# EAGLE design blade-plate-head (EAGLE 9.6.0)
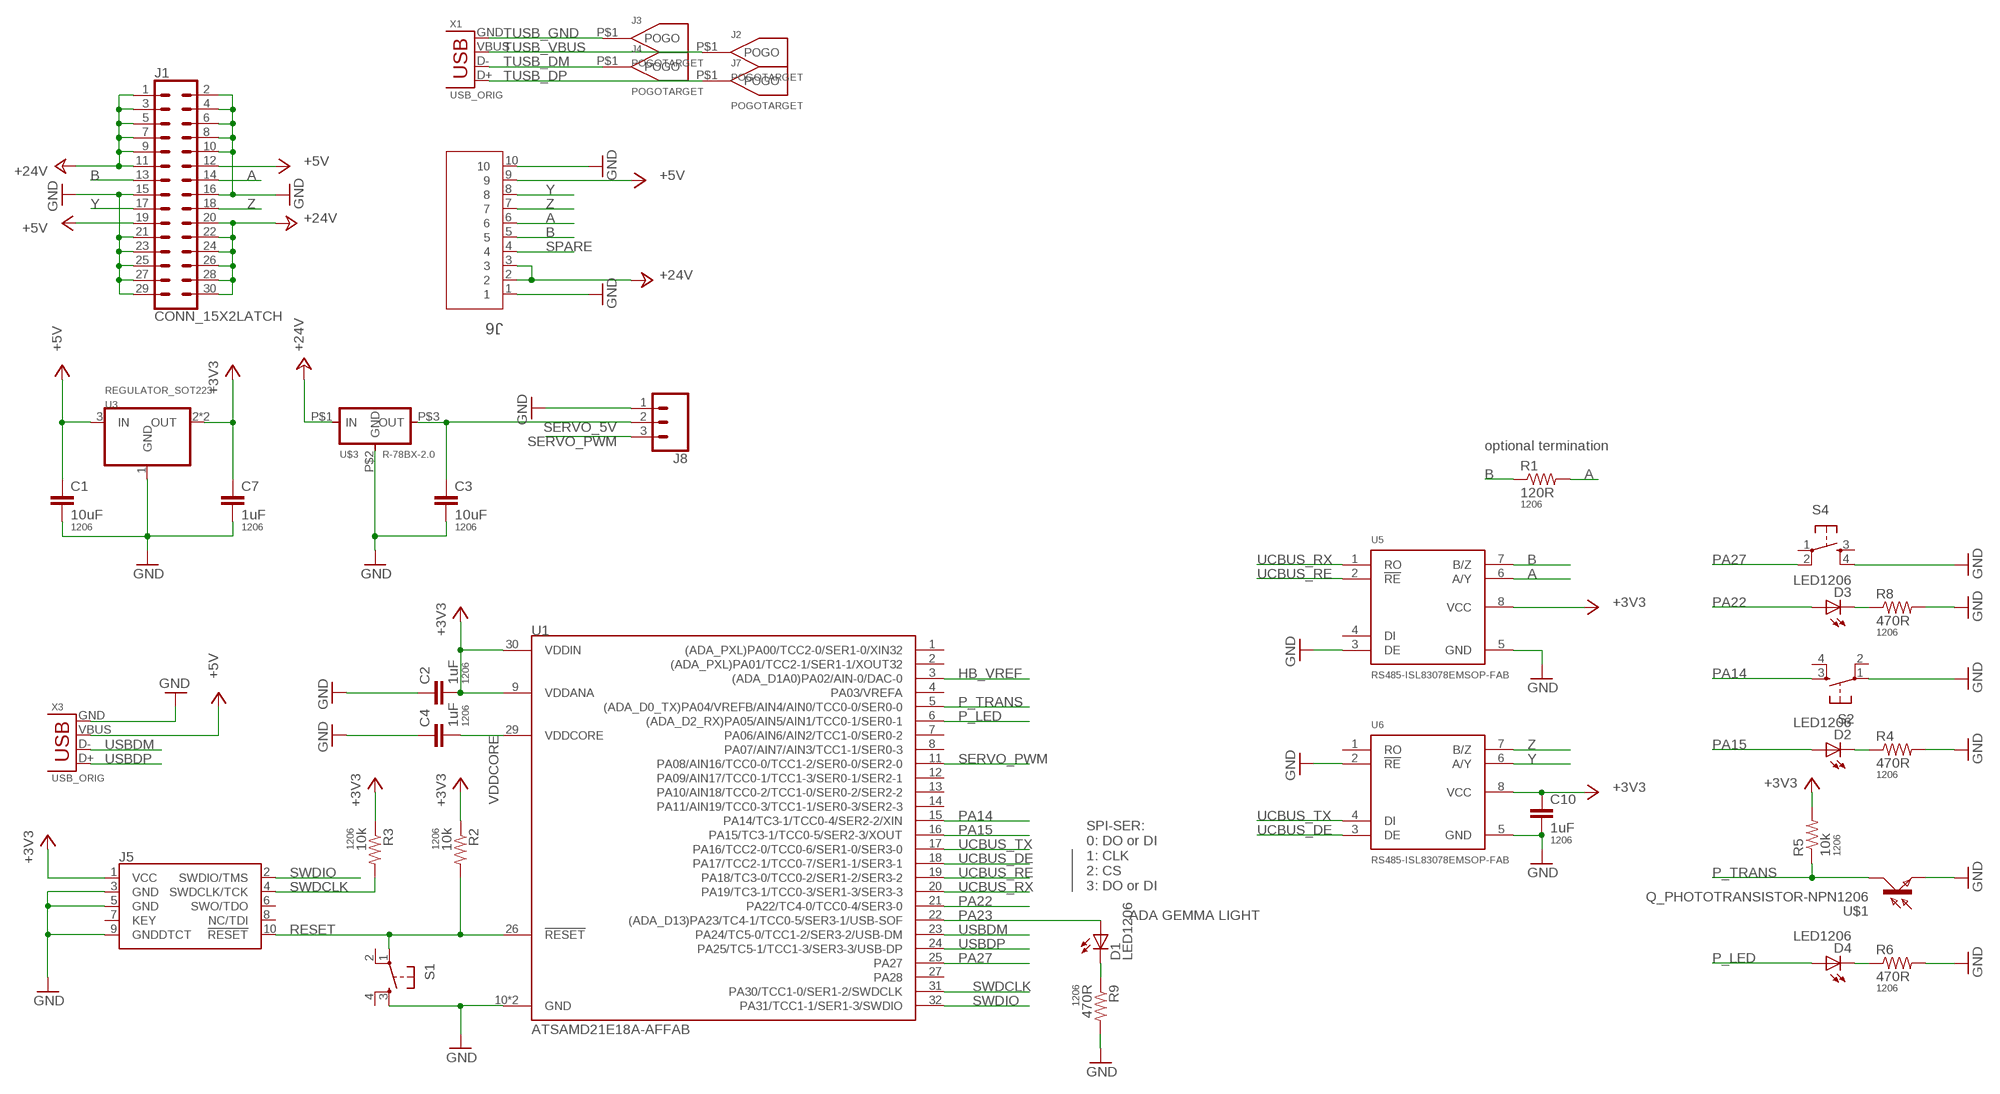
[diagram p0: schematic, sheet 1]

## Parts
C1  10uF  CAP1206  [1206]
C2  1uF  CAP1206  [1206]
C3  10uF  CAP1206  [1206]
C4  1uF  CAP1206  [1206]
C7  1uF  CAP1206  [1206]
C10  1uF  CAP1206  [1206]
D1  LED1206  [LED1206]
D2  LED1206  [LED1206]
D3  LED1206  [LED1206]
D4  LED1206  [LED1206]
J1  CONN_15X2LATCH  [2X15-SHROUDED_LATCH]
J2  POGOTARGET  [POGO_TARGET]
J3  POGOTARGET  [POGO_TARGET]
J4  POGOTARGET  [POGO_TARGET]
J5  CORTEX_JTAG_DEBUG_PTH_NS  [2X5-PTH-1.27MM-NO_SILK]
J6  BLADE_10P_SCKT_1-1674231-1  [TE_1-1674231-1]
J7  POGOTARGET  [POGO_TARGET]
J8  CONN_03LOCK_NO_SILK  [1X03_LOCK_NO_SILK]
R1  120R  RESISTOR1206  [1206]
R2  10k  RESISTOR1206  [1206]
R3  10k  RESISTOR1206  [1206]
R4  470R  RESISTOR1206  [1206]
R5  10k  RESISTOR1206  [1206]
R6  470R  RESISTOR1206  [1206]
R8  470R  RESISTOR1206  [1206]
R9  470R  RESISTOR1206  [1206]
S1  SW_SWITCH_TACTILE_6MM6MM_SWITCH  [6MM_SWITCH]
S2  SW_SWITCH_TACTILE_6MM6MM_SWITCH  [6MM_SWITCH]
S4  SW_SWITCH_TACTILE_6MM6MM_SWITCH  [6MM_SWITCH]
U1  ATSAMD21E18A-AFFAB  [TQFP-32-FAB]
U3  REGULATOR_SOT223  [SOT223]
U5  RS485-ISL83078EMSOP-FAB  [8-MSOP-FAB]
U6  RS485-ISL83078EMSOP-FAB  [8-MSOP-FAB]
U$1  Q_PHOTOTRANSISTOR-NPN1206  [OP1206]
U$3  R-78BX-2.0  [R-78BX-2.0]
X1  USB_ORIG  [DX4R005HJ5]
X3  USB_ORIG  [DX4R005HJ5]

## Nets
+3V3: C2.2 C7.1 C10.1 J5.1(VCC) R2.1 R3.1 R5.2 U1.9(VDDANA) U1.30(VDDIN) U3.2(OUT) U3.4(OUT) U5.8(VCC) U6.8(VCC)
+5V: C1.1 J1.12 J1.19 J6.9 U3.3(IN) X3.VBUS
+24V: J1.1 J1.3 J1.5 J1.7 J1.9 J1.11 J1.20 J1.22 J1.24 J1.26 J1.28 J1.30 J6.2 J6.3 U$3.P$1(IN)
A: J1.14 J6.6 R1.2 U5.6(A/Y)
B: J1.13 J6.5 R1.1 U5.7(B/Z)
GND: C1.2 C2.1 C3.2 C4.1 C7.2 C10.2 J1.2 J1.4 J1.6 J1.8 J1.10 J1.15 J1.16 J1.21 J1.23 J1.25 J1.27 J1.29 J5.3(GND) J5.5(GND) J5.9(GNDDTCT) J6.1 J6.10 J8.1 R4.2 R6.2 R8.2 R9.2 S1.3(S) S2.1(P) S4.4(S1) U1.10(GND) U1.28(GND) U3.1(GND) U5.3(DE) U5.5(GND) U6.2(!RE) U6.5(GND) U$1.EMITTER(E) U$3.P$2(GND) X3.GND
HB_VREF: U1.3((ADA_D1A0)PA02/AIN-0/DAC-0)
N$1: D3.2(C) R8.1
N$2: D2.2(C) R4.1
N$3: D4.2(C) R6.1
N$6: D1.2(C) R9.1
P_LED: D4.1(A) U1.6((ADA_D2_RX)PA05/AIN5/AIN1/TCC0-1/SER0-1)
P_TRANS: R5.1 U1.5((ADA_D0_TX)PA04/VREFB/AIN4/AIN0/TCC0-0/SER0-0) U$1.COLLECTOR(C)
PA14: S2.3(S) U1.15(PA14/TC3-1/TCC0-4/SER2-2/XIN)
PA15: D2.1(A) U1.16(PA15/TC3-1/TCC0-5/SER2-3/XOUT)
PA22: D3.1(A) U1.21(PA22/TC4-0/TCC0-4/SER3-0)
PA23: D1.1(A) U1.22((ADA_D13)PA23/TC4-1/TCC0-5/SER3-1/USB-SOF)
PA27: S4.2(P1) U1.25(PA27)
RESET: J5.10(!RESET) R2.2 S1.1(P) U1.26(!RESET)
SERVO_5V: C3.1 J8.2 U$3.P$3(OUT)
SERVO_PWM: J8.3 U1.11(PA08/AIN16/TCC0-0/TCC1-2/SER0-0/SER2-0)
SPARE: J6.4
SWDCLK: J5.4(SWDCLK/TCK) R3.2 U1.31(PA30/TCC1-0/SER1-2/SWDCLK)
SWDIO: J5.2(SWDIO/TMS) U1.32(PA31/TCC1-1/SER1-3/SWDIO)
TUSB_DM: J4.P$1(POGO) X1.D-
TUSB_DP: J7.P$1(POGO) X1.D+
TUSB_GND: J3.P$1(POGO) X1.GND
TUSB_VBUS: J2.P$1(POGO) X1.VBUS
UCBUS_DE: U1.18(PA17/TCC2-1/TCC0-7/SER1-1/SER3-1) U6.3(DE)
UCBUS_RE: U1.19(PA18/TC3-0/TCC0-2/SER1-2/SER3-2) U5.2(!RE)
UCBUS_RX: U1.20(PA19/TC3-1/TCC0-3/SER1-3/SER3-3) U5.1(RO)
UCBUS_TX: U1.17(PA16/TCC2-0/TCC0-6/SER1-0/SER3-0) U6.4(DI)
USBDM: U1.23(PA24/TC5-0/TCC1-2/SER3-2/USB-DM) X3.D-
USBDP: U1.24(PA25/TC5-1/TCC1-3/SER3-3/USB-DP) X3.D+
VDDCORE: C4.2 U1.29(VDDCORE)
Y: J1.17 J6.8 U6.6(A/Y)
Z: J1.18 J6.7 U6.7(B/Z)
Unconnected: J5.6(SWO/TDO) J5.7(KEY) J5.8(NC/TDI) S1.2(P1) S1.4(S1) S2.2(P1) S2.4(S1) S4.1(P) S4.3(S) U1.1((ADA_PXL)PA00/TCC2-0/SER1-0/XIN32) U1.2((ADA_PXL)PA01/TCC2-1/SER1-1/XOUT32) U1.4(PA03/VREFA) U1.7(PA06/AIN6/AIN2/TCC1-0/SER0-2) U1.8(PA07/AIN7/AIN3/TCC1-1/SER0-3) U1.12(PA09/AIN17/TCC0-1/TCC1-3/SER0-1/SER2-1) U1.13(PA10/AIN18/TCC0-2/TCC1-0/SER0-2/SER2-2) U1.14(PA11/AIN19/TCC0-3/TCC1-1/SER0-3/SER2-3) U1.27(PA28) U5.4(DI) U6.1(RO)

## Notes on the sheet
- optional termination
- SPI-SER:
  0: DO or DI
  1: CLK
  2: CS
  3: DO or DI
- ADA GEMMA LIGHT

## Library data of the parts
C1-C4 C7 C10 = passives:CAP: Capacitor Standard 0603 ceramic capacitor, and 0.1" leaded capacitor.; PACKAGE: 1206
D1-D4 = lights:LED: LED
J1 = SparkFun-Connectors:CONN_15X2
J2-J4 J7 = connector:POGO
J5 = SparkFun-Connectors:CORTEX_JTAG_DEBUG: Cortex Debug Connector - 10 pin Supports JTAG debug, Serial Wire debug, and Serial Wire Viewer. PTH and SMD connector options available. General Connector Information <http://infocenter.arm.com/help/topic/com.arm.doc.faqs/attached/13634/cortex_debug_connectors.pdf> Products: PTH Connector <http://www.digikey.com/product-detail/en/cnc-tech/3220-10-0100-00/1175-1627-ND/3883661> -via Digi-Key SparkFun PSoc <https://www.sparkfun.com/products/13229> SparkFun T <https://www.sparkfun.com/products/13810>
J6 = connector:BLADE_10P_SCKT_1-1674231-1: Check prices <https://pricing.snapeda.com/parts/1-1674231-1/TE%20Connectivity/view-part?ref=eda>; AVAILABILITY: In Stock; COMMENT: 1-1674231-1; DESCRIPTION: Conn Battery RCP 10Power POS 2.5mm Solder ST Thru-Hole 10 Terminal 1 Port Tray; EU_ROHS_COMPLIANCE: Compliant; MF: TE Connectivity; MP: 1-1674231-1; PACKAGE: None; PRICE: None; PURCHASE-URL: https://pricing.snapeda.com/search/part/1-1674231-1/?ref=eda
J8 = SparkFun-Connectors:CONN_03: Multi connection point. Often used as Generic Header-pin footprint for 0.1 inch spaced/style header connections On any of the 0.1 inch spaced packages, you can populate with these: Break Away Headers - Straight <https://www.sparkfun.com/products/116> (PRT-00116) Break Away Male Headers - Right Angle <https://www.sparkfun.com/products/553> (PRT-00553) Female Headers <https://www.sparkfun.com/products/115> (PRT-00115) Break Away Headers - Machine Pin <https://www.sparkfun.com/products/117> (PRT-00117) Break Away Female Headers - Swiss Machine Pin <https://www.sparkfun.com/products/743> (PRT-00743) Stackable Header - 3 Pin (Female, 0.1") <https://www.sparkfun.com/products/13875> (PRT-13875) For SCREWTERMINALS and SPRING TERMINALS visit here: Screw Terimnals on SparkFun.com <https://www.sparkfun.com/search/results?term=Screw+Terminals> (5mm/3.5mm/2.54mm spacing) This device is also useful as a general connection point to wire up your design to another part of your project. Our various solder wires solder well into these plated through hole pads. Hook-Up Wire - Assortment (Stranded, 22 AWG) <https://www.sparkfun.com/products/11375> (PRT-11375) Hook-Up Wire - Assortment (Solid Core, 22 AWG) <https://www.sparkfun.com/products/11367> (PRT-11367) View the entire wire category on our website here <https://www.sparkfun.com/categories/141> Special notes: Molex polarized connector foot print use with SKU : PRT-08232 with associated crimp pins and housings.
R1-R6 R8 R9 = passives:RESISTOR: Resistor Basic schematic elements and footprints for 0603, 1206, and PTH resistors.; PACKAGE: 1206
S1 S2 S4 = fablab:SW_SWITCH_TACTILE_6MM: OMRON SWITCH
U1 = microcontrollers:ATSAMD21E18A-AF: The SAM D21 is a series of low-power microcontrollers using the 32-bit ARM® Cortex® -M0+ processor, and ranging from 32- to 64-pins with up to 256KB Flash and 32KB of SRAM. The SAM D21 operate at a maximum frequency of 48MHz and reach 2.46 CoreMark® /MHz. Check prices <https://pricing.snapeda.com/parts/ATSAMD21E18A-AF/Microchip/view-part?ref=eda>
U3 = power:REGULATOR_SOT223
U5 U6 = comm:RS485-ISL83078E
U$1 = fablab:Q_PHOTOTRANSISTOR-NPN
U$3 = power:R-78BX-2.0
X1 X3 = connector:USB: SMD micro USB connector as found in the fablab inventory. Three footprint variants included: 609-4613-1-ND used by Jake original, as described by manufacturer's datasheet for milling with the 1/100" bit for milling with the 1/64" bit Made by Zaerc.

## Board
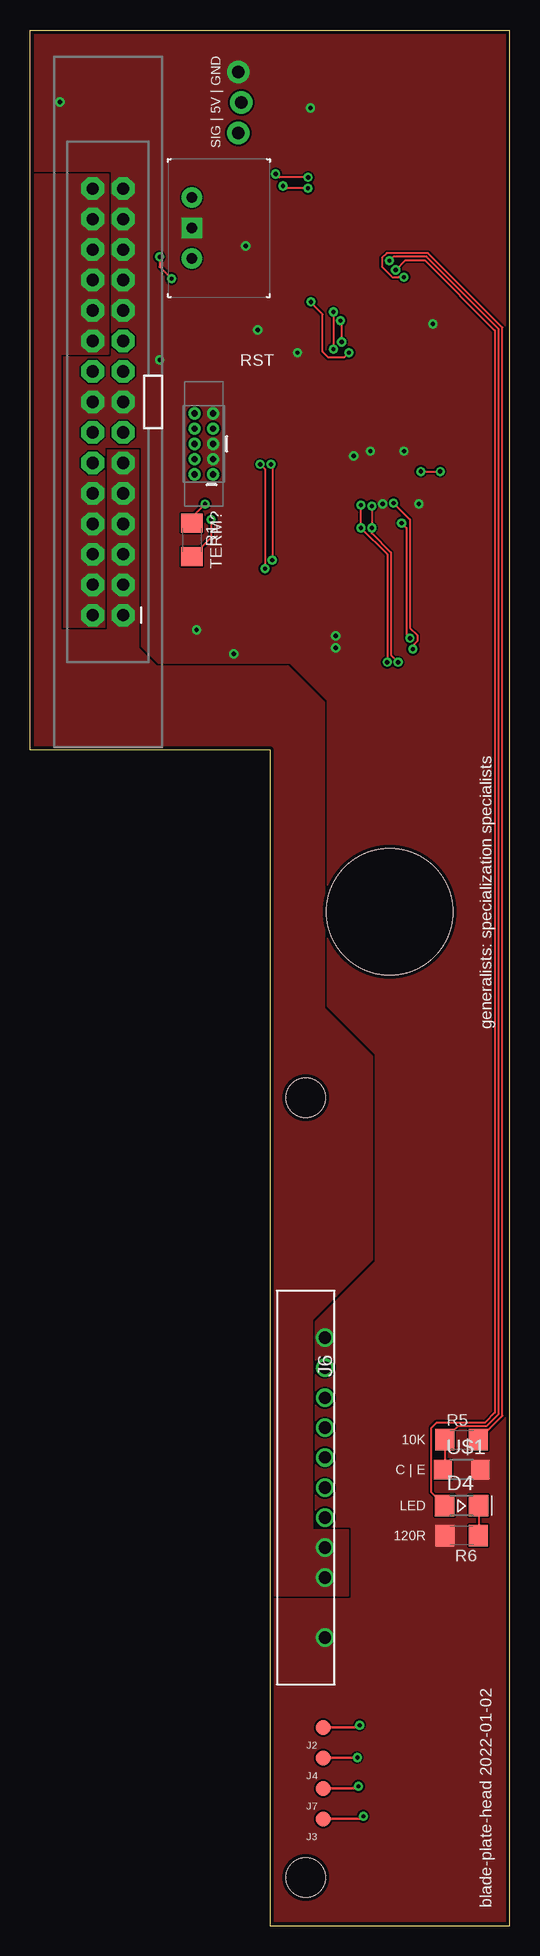
[diagram p1: board, top side]
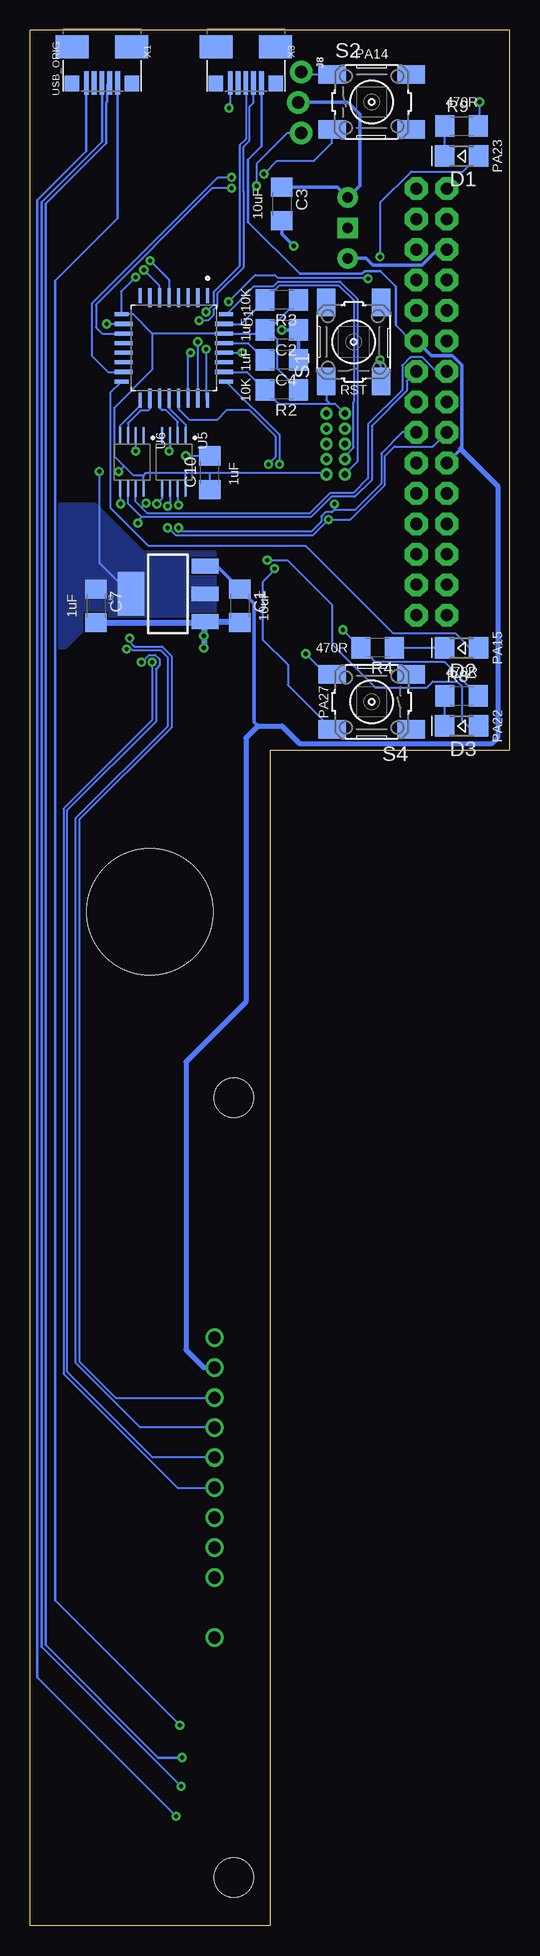
[diagram p2: board, bottom side, seen from below]

Size 40 x 158 mm. Coordinates in mm from the lower left corner, seen from the top.
Outline: 20,0 40,0 40,158 0,158 0,98 20,98 20,0
Copper layers (1*16): Top 0.035mm / dielectric 1.5mm / Bottom 0.035mm
Design rules "default *": minimum track width 6mil, minimum drill 0.35mm, track to track 6mil, track to pad 6mil, pad to pad 6mil, via to via 6mil, smd to smd 6mil, copper to edge 12mil, drill to drill 6mil, minimum pad ring 10mil, minimum via ring 8mil, stop-mask expansion 4mil, vias tented up to drill 35mil, thermal gap 10mil
Holes 3.25 mm at 23,69 23,4
Holes 10.5 mm at 30,84.5

### Footprints (pad centres in the part's own frame; a part is rotated, then mirrored left to right if it is on the bottom)
1206 = smd 1.6 x 1.8: 1 -1.4,0; 2 1.4,0
LED1206 = smd 1.6 x 1.803: 1 -1.422,0; 2 1.422,0
2X15-SHROUDED_LATCH = drill 1.016 pad 1.88 octagon: 1 -1.27,17.78; 2 1.27,17.78; 3 -1.27,15.24; 4 1.27,15.24; 5 -1.27,12.7; 6 1.27,12.7; 7 -1.27,10.16; 8 1.27,10.16; 9 -1.27,7.62; 10 1.27,7.62; 11 -1.27,5.08; 12 1.27,5.08; 13 -1.27,2.54; 14 1.27,2.54; 15 -1.27,0; 16 1.27,0; 17 -1.27,-2.54; 18 1.27,-2.54; 19 -1.27,-5.08; 20 1.27,-5.08; 21 -1.27,-7.62; 22 1.27,-7.62; 23 -1.27,-10.16; 24 1.27,-10.16; 25 -1.27,-12.7; 26 1.27,-12.7; 27 -1.27,-15.24; 28 1.27,-15.24; 29 -1.27,-17.78; 30 1.27,-17.78
POGO_TARGET = smd 1.27 x 1.27: P$1 0,0
2X5-PTH-1.27MM-NO_SILK = drill 0.508 pad 1: 1 -2.54,-0.762; 2 -2.54,0.762; 3 -1.27,-0.762; 4 -1.27,0.762; 5 0,-0.762; 6 0,0.762; 7 1.27,-0.762; 8 1.27,0.762; 9 2.54,-0.762; 10 2.54,0.762
TE_1-1674231-1 = drill 1.016 pad 1.524: 1 -12.5,0; 2 -7.496,0; 3 -5.007,0; 4 -2.492,0; 5 -0.003,0; 6 2.511,0; 7 5.001,0; 8 7.49,0; 9 10.004,0; 10 12.494,0
1X03_LOCK_NO_SILK = drill 1.016 pad 1.88: 1 0,0.127; 2 2.54,-0.127; 3 5.08,0.127
6MM_SWITCH = smd 2.286 x 1.524: 1 -3.302,2.286; 2 3.302,2.286; 3 -3.302,-2.286; 4 3.302,-2.286
TQFP-32-FAB = smd 1.25 x 0.35: 1 -4.355,2.8; 8 -4.355,-2.8; 17 4.355,-2.8; 24 4.355,2.8 | smd 1.6 x 0.35: 2 -4.18,2; 3 -4.18,1.2; 4 -4.18,0.4; 5 -4.18,-0.4; 6 -4.18,-1.2; 7 -4.18,-2; 18 4.18,-2; 19 4.18,-1.2; 20 4.18,-0.4; 21 4.18,0.4; 22 4.18,1.2; 23 4.18,2 | smd 0.35 x 1.25: 9 -2.8,-4.355; 16 2.8,-4.355; 25 2.8,4.355; 32 -2.8,4.355 | smd 0.35 x 1.6: 10 -2,-4.18; 11 -1.2,-4.18; 12 -0.4,-4.18; 13 0.4,-4.18; 14 1.2,-4.18; 15 2,-4.18; 26 2,4.18; 27 1.2,4.18; 28 0.4,4.18; 29 -0.4,4.18; 30 -1.2,4.18; 31 -2,4.18
SOT223 = smd 1.219 x 2.235: 1 -2.311,-3.099; 2 0,-3.099; 3 2.311,-3.099 | smd 3.6 x 2.2: 4 0,3.099
8-MSOP-FAB = smd 1.4 x 0.22: 1 -2.2,0.975; 2 -2.2,0.325; 3 -2.2,-0.325; 4 -2.2,-0.975; 5 2.2,-0.975; 6 2.2,-0.325; 7 2.2,0.325; 8 2.2,0.975
OP1206 = smd 1.5 x 1.6: COLLECTOR -1.55,0; EMITTER 1.55,0
R-78BX-2.0 = drill 0.9 pad 1.676: P$1 -2.54,0; P$3 2.54,0 | drill 0.9 pad 1.676 square: P$2 0,0
DX4R005HJ5 = smd 0.4 x 1.95: D+ 0,1.9; D- -0.65,1.9; GND 1.3,1.9; ID 0.65,1.9; VBUS -1.3,1.9 | smd 1.2 x 1.3: GND@1 -2.5,1.95; GND@2 2.5,1.95 | smd 2.75 x 1.9: GND@3 -2.475,-1.1; GND@4 2.475,-1.1

### Placement (x,y rotation side)
C1  22.5,110 270 bottom
C2  19,133 180 bottom
C3  19,143.5 270 bottom
C4  19,130.5 180 bottom
C7  34.5,110 270 bottom
C10  25,121.1 90 bottom
D1  4,147.5 180 bottom
D2  4,106.5 180 bottom
D3  4,100 180 bottom
D4  36,35 0 top
J1  6.5,127 180 top
J2  24.45,16.51 0 top
J3  24.45,8.89 0 top
J4  24.45,13.97 0 top
J5  14.5,123.5 90 top
J6  24.6,36.5 90 top
J7  24.45,11.43 0 top
J8  17.5,154.5 270 bottom
R1  13.5,115.5 270 top
R2  19,128 180 bottom
R3  19,135.5 180 bottom
R4  11,106.5 180 bottom
R5  36,40.5 0 top
R6  36,32.5 180 top
R8  4,102.5 0 bottom
R9  4,150 0 bottom
S1  13,132 90 bottom
S2  11.5,152 0 bottom
S4  11.5,102 180 bottom
U1  28,131.5 270 bottom
U3  28.5,111 90 bottom
U5  28,122 270 bottom
U6  31.5,122 270 bottom
U$1  36,38 0 top
U$3  13.5,141.5 90 top
X1  34,155.5 180 bottom
X3  22,155.5 180 bottom

### Tracks (layer width: path | path; a pad name or v marks a point on that pad's centre or on a via)
+3V3  (via drill 0.35)
  Top 0.152: v32.6,121.2 v34.22,121.2 | R5.2 39.4,42.5 39.4,133.2 33.19,139.41 29.77,139.41 29.37,139.01 29.37,138.27 30.25,137.39 30.75,137.39 30.77,137.41 v31.19,137.41
  Bottom 0.152: 20.2,133 C2.2 20.7,132.7 U1.30 29.8,132.7 | 20.2,133 20.1,133 R3.1 | R2.1 19.37,129.77 19.37,132.17 20.2,133 | 29.8,132.7 31.4,134.3 32.3,134.3 | 32.3,134.3 U1.9 | U6.8 30.52,120.88 30.5,120.9 | 26.9,121.1 30.3,121.1 30.5,120.9 | U5.8 27.02,120.97 26.9,121.1 | J5.1 15.4,121.1 25,121.1 | 26.9,121.1 25,121.1 | C10.1 25,121.1 | 30.5,120.9 31.4,120.9 32.1,121.6 | 29.8,132.7 29.8,129.7 33,126.5 33,122.5 32.1,121.6 | 32.1,121.6 32.2,121.6 v32.6,121.2 | v34.22,121.2 34.22,113.62 U3.4 | 32.3,134.3 32.4,134.4 32.4,136.2 v31.19,137.41
  pour Bottom (no thermals): 24.5,114.5 30.5,114.5 34.5,118.5 40.5,118.5 40.5,106.5 37,106.5 35,108.5 24.5,108.5
+5V
  Bottom 0.203: J1.19 8.18,132.08 9.5,133.4 9.5,136.62 10.78,137.9 12.06,137.9 12.29,137.67 17.47,137.67 21.8,142 21.8,147.2 20.7,148.3 X3.VBUS
  Bottom 0.305: U3.3 24.41,113.31 C1.1 21.3,110.19 21.3,100.3 21,100 | J1.19 6.53,130.84 4.77,130.84 3.98,130.06 3.98,123.17 4.07,123.08 J1.12
  Bottom 0.406: 4.07,123.08 1,120 1,99 1.49,98.51 17.5,98.51 19,100 21,100 22,99 22,77 27,72 27,48 25.5,46.5 J6.9
+24V
  Bottom 0.305: J1.26 6.01,139.7 7.3,138.41 11.4,138.41 12,139 13.46,139 U$3.P$1
  pour Top (rank 2, no thermals): -0.5,146 6.5,146 6.5,131 2.5,131 2.5,108 6.5,108 6.5,123 9,123 9,106.5 10.5,105 21.5,105 24.5,102 24.5,76.5 28.5,72.5 28.5,55.5 23.5,50.5 23.5,33 26.5,33 26.5,27.5 -0.5,27.5
A  (via drill 0.35)
  Top 0.152: v28.51,118.31 v28.51,116.5 28.51,116.05 30.11,114.45 30.11,105.9 v30.71,105.3 | v15.1,117.2 15.1,115.7 R1.2
  Bottom 0.152: U5.6 28.32,118.5 v28.51,118.31 | v28.51,116.5 28.46,116.5 27.85,115.89 16.41,115.89 v15.1,117.2 v15.09,117.19 13.27,117.19 10.39,120.07 10.39,122.5 9.6,123.29 6.4,123.29 J1.14 | J6.6 29.78,39.01 36.89,46.13 36.89,92.97 29.49,100.37 29.49,104.75 29.19,105.05 29.19,105.55 29.55,105.91 30.05,105.91 30.66,105.3 v30.71,105.3
B  (via drill 0.35)
  Top 0.152: v27.6,118.4 v27.6,116.5 29.8,114.3 v29.8,105.3 | v14.6,118.49 13.5,117.39 R1.1
  Bottom 0.152: J1.13 8.94,124.46 10.7,122.7 10.7,120.2 12.9,118 14.6,118 | v27.6,116.5 27.3,116.2 16.53,116.2 15.71,117.02 15.71,117.45 15.35,117.81 14.79,117.81 14.6,118 | U5.7 27.68,118.47 v27.6,118.4 | v29.8,105.3 29.8,100.5 37.2,93.1 37.2,46 27.7,36.5 J6.5 | v14.6,118.49 14.6,118
GND  (via drill 0.35)
  Bottom 0.152: U1.28 v22.3,131.1 | U1.10 v33.6,133.5 | U6.2 31.2,124.17 v31.2,122.9 | U5.3 28.32,122.97 v28.4,122.9 | U6.5 32.48,118.54 v32.43,118.5 | U5.5 28.98,118.94 v29.42,118.5 | C10.2 v27,122.5 | S4.4 15.29,104.29 v17,106 | R8.2 5.4,105.3 11.2,105.3 R4.2 v13.9,108 | X3.GND 23.3,151.6 v23.4,151.5 | S2.1 17.16,154.29 J8.1 | R9.2 2.5,150.1 v2.5,152 | S1.3 10.71,130.41 v10.8,130.5
  Bottom 0.305: C4.1 C2.1 v19,133 | C3.2 19,141 v18,140
  Bottom 0.508: C7.2 25.49,108.6 U3.1 | U3.1 22.59,108.69 C1.2 | U3.1 25.5,108.59 v25.5,107.5 v25.5,106.5
  pour Top (rank 6, no thermals): 41,158.5 -1,158.5 -1,-1 41,-1
N$1
  Bottom 0.152: R8.1 5.42,102.48 D3.2
N$2
  Bottom 0.152: D2.2 R4.1
N$3
  Top 0.152: D4.2 37.42,32.52 R6.1
N$6
  Bottom 0.152: R9.1 5.42,149.98 D1.2
P_LED  (via drill 0.35)
  Top 0.152: D4.1 33.47,36.11 33.47,41.47 33.93,41.93 37.97,41.93 38.79,42.75 38.79,132.95 32.94,138.8 31.3,138.8 v30.5,138
  Bottom 0.152: U1.6 29.2,136.7 v30.5,138
P_TRANS  (via drill 0.35)
  Top 0.152: U$1.COLLECTOR 34.6,38.15 R5.1 35.73,41.63 38.1,41.63 39.09,42.63 39.09,133.07 33.06,139.1 30.32,139.1 v29.98,138.76
  Bottom 0.152: v29.98,138.76 28.4,137.19 U1.5
PA14  (via drill 0.35)
  Top 0.152: v23.2,145.71 20.78,145.71 v20.49,146
  Bottom 0.152: v23.2,145.71 24.32,145.71 34.8,135.23 34.8,130.81 33.5,129.5 U1.15 | v20.49,146 19.39,147.1 16.3,147.1 14.8,148.6 S2.3
PA15
  Bottom 0.152: U1.16 33.3,127.75 33.3,118.2 30.1,115 17,115 9.7,107.7 4.5,107.7 3.3,106.5 D2.1
PA22  (via drill 0.35)
  Top 0.152: v20.11,121.8 20.21,121.7 v20.21,113.8
  Bottom 0.152: U1.21 27.6,126.4 26.7,125.5 24.4,125.5 23.61,126.3 21.67,126.3 19.5,124.13 19.5,122.4 v20.11,121.8 | v20.21,113.8 18.5,113.8 14.8,110.1 14.8,106.8 11.2,103.2 6.9,103.2 6.4,103.7 4.4,103.7 4,103.3 4,100.5 3.5,100 D3.1
PA23  (via drill 0.35)
  Top 0.152: v26.61,131.1 26.21,130.7 24.9,130.7 24.4,131.2 24.4,134.3 23.4,135.3 v23.44,135.34 | v10.8,139.09 10.8,138.27 v11.8,137.27
  Bottom 0.152: U1.22 26.8,130.91 v26.61,131.1 | v23.44,135.34 21.21,137.57 19.57,137.57 19.34,137.34 11.87,137.34 v11.8,137.27 | v10.8,139.09 10.8,143.6 8.2,146.2 3.88,146.2 D1.1
PA27  (via drill 0.35)
  Top 0.152: v19.2,121.8 19.6,121.4 v19.6,113.1
  Bottom 0.152: U1.25 19.2,124.25 v19.2,121.8 | v19.6,113.1 19.6,113 20.6,112 20.6,107.2 18.5,105.1 18.5,103.41 S4.2
RESET
  Bottom 0.152: U1.26 21.9,129.5 R2.2 19.27,126.87 15,126.87 | J5.10 14.57,126.87 15,126.87 | S1.1 15.29,127.16 15,126.87
SERVO_5V
  Bottom 0.305: J8.2 13.46,151.96 12.5,151 12.5,145.04 U$3.P$3 14.36,144.9 C3.1
SERVO_PWM  (via drill 0.35)
  Top 0.152: v23.2,144.81 21.3,144.81 v21.1,145
  Bottom 0.152: v21.1,145 21.1,146.85 18.53,149.42 J8.3 | v23.2,144.81 24.8,144.81 34.5,135.1 34.5,133.2 34,132.7 U1.11
SWDCLK
  Bottom 0.152: U1.31 22.4,133.5 R3.2 19.17,136.73 14.26,136.73 13,135.47 13,127 13,123.19 13.74,122.46 J5.4
SWDIO
  Bottom 0.152: U1.32 23.62,134.3 21.3,136.63 19.7,136.63 19.3,137.03 14.13,137.03 12.7,135.59 12.7,126.87 12.7,122 J5.2
TUSB_DM  (via drill 0.35)
  Top 0.203: v27.3,14 27.27,13.97 J4.P$1
  Bottom 0.203: X1.D- 33.55,153.4 33.55,152.02 33.64,151.92 33.64,148.55 38.68,143.51 38.68,23.39 29.3,14 v27.3,14
TUSB_DP  (via drill 0.35)
  Top 0.203: J7.P$1 27.23,11.43 v27.4,11.6
  Bottom 0.203: v27.4,11.6 39.04,23.24 39.04,143.66 34,148.7 X1.D+
TUSB_GND  (via drill 0.35)
  Top 0.203: v27.8,9.1 27.59,8.89 J3.P$1
  Bottom 0.203: X1.GND 35.3,147.9 39.39,143.81 39.39,20.69 v27.8,9.1
TUSB_VBUS  (via drill 0.35)
  Top 0.203: J2.P$1 27.31,16.51 v27.5,16.7
  Bottom 0.203: X1.VBUS 32.7,142.3 37.9,137.1 37.9,27.1 v27.5,16.7
UCBUS_DE
  Bottom 0.152: U1.18 30,126.45 30.16,126.29 30.78,126.29 31.82,125.24 U6.3
UCBUS_RE
  Bottom 0.152: U5.2 27.68,125.34 28.63,126.3 29,126.3 29.2,126.5 U1.19
UCBUS_RX
  Bottom 0.152: U1.20 28.4,126.5 27.02,125.12 U5.1
UCBUS_TX
  Bottom 0.152: U6.4 32.48,125.03 30.8,126.7 U1.17
USBDM  (via drill 0.35)
  Top 0.152: v26,132 26,133.69 v25.91,133.78
  Bottom 0.152: U1.23 v26,132 | v25.91,133.78 25.16,133.78 24.69,134.25 24.69,134.68 24.39,134.97 24.39,136 22.2,138.2 22.2,144.54 22.21,144.55 22.21,148.26 21.7,148.77 21.7,151.6 21.35,151.95 X3.D-
USBDP  (via drill 0.35)
  Top 0.152: v25.3,134.5 v25.3,131.39
  Bottom 0.152: v25.3,131.39 25.3,127.25 U1.24 | v25.3,134.5 24.7,135.1 24.7,136.13 22.51,138.32 22.51,148.39 22,148.9 X3.D+
VDDCORE
  Bottom 0.152: U1.29 21.8,131.9 C4.2
Y  (via drill 0.35)
  Top 0.152: v31,116.9 31.4,116.5 31.4,107.6 v31.7,107.3
  Bottom 0.152: U6.6 31.82,118.53 30.7,117.4 | J1.17 8.57,128.74 8.57,127.93 11.5,125 11.5,120.5 12.9,119.1 14.85,119.1 16.55,117.4 30.7,117.4 | 30.7,117.4 31,117.1 v31,116.9 | J6.8 32.86,43.99 35.89,47.03 35.89,92.17 28.2,99.87 28.2,105.83 28.97,106.61 31.3,106.61 31.7,107 v31.7,107.3
Z  (via drill 0.35)
  Top 0.152: v30.33,118.57 31.7,117.19 31.7,108.15 32.31,107.55 32.31,107.05 31.95,106.69 v31.95,106.39
  Bottom 0.152: J1.18 6.12,129.54 7.29,130.71 8.25,130.71 8.94,130.02 8.94,127.99 11.8,125.13 11.8,120.63 13.03,119.41 14.98,119.41 16.68,117.7 30.2,117.7 30.75,118.25 | U6.7 31.18,118.67 30.75,118.25 | 30.75,118.25 30.65,118.25 v30.33,118.57 | J6.7 30.8,41.5 36.2,46.9 36.2,92.3 28.5,100 28.5,105.7 29.1,106.3 31.43,106.3 31.52,106.39 v31.95,106.39

### Text on the board
tPlace: SIG | 5V | GND | RST | TERM? | generalists: specialization specialists | 10K | C | E | LED | 120R | blade-plate-head 2022-01-02
bPlace: PA14 | 470R | PA23 | 10uF | 10K | 1uF | 1uF | RST | 10K | 1uF | 10uF | 1uF | PA15 | 470R | 470R | PA27 | PA22